# EAGLE schematic EpicWelcomeMusic (EAGLE 6.2)
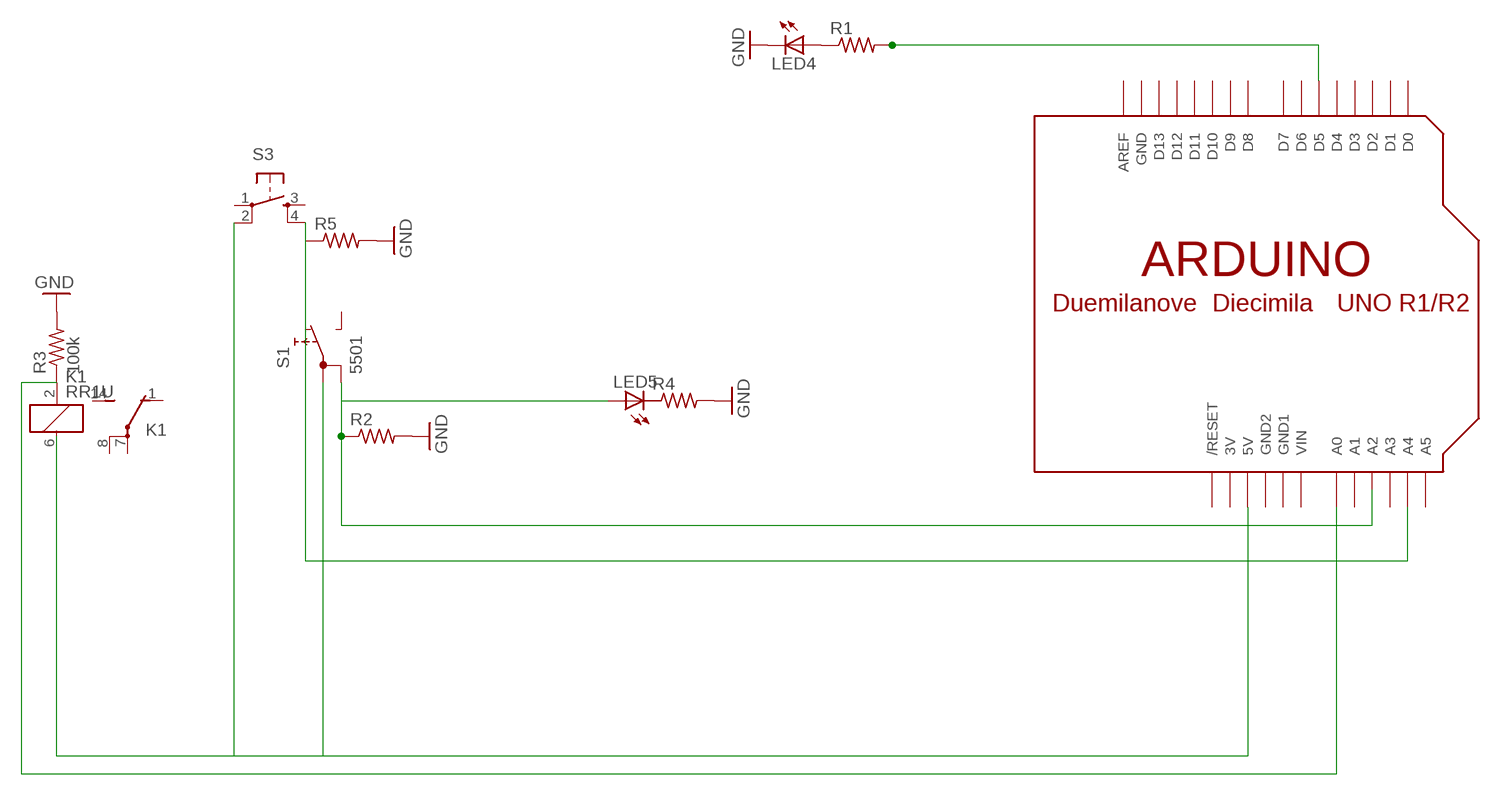
[diagram p0: schematic, sheet 1]

## Parts
K1  RR1U  [RR1U]
LED4  LED10MM  [LED10MM]
LED5  LED10MM  [LED10MM]
R1  R-US_0414/15  [0414/15]
R2  R-US_0414/15  [0414/15]
R3  100k  R-US_0414/15  [0414/15]
R4  R-US_0414/15  [0414/15]
R5  R-US_0414/15  [0414/15]
S1  5501  [5501]
S3  TAC_SWITCHPTH  [TACTILE-PTH]
U$1  ARDUINO-BPLACE  [ARDUINO-BPLACE]

## Nets
GND: LED4.C R2.2 R3.2 R4.2 R5.2
N$1: S1.1A S3.2 U$1.5V
N$2: K1.2 R3.1 U$1.A0
N$3: R1.2 U$1.D5
N$4: R5.1 S3.4 U$1.A4
N$5: LED4.A R1.1
N$6: LED5.A R2.1 S1.1B
Unconnected: K1.1(2:O) K1.6 K1.7(2:P) K1.8(2:P) K1.14(2:S) LED5.C R4.1 S1.NC S1.NO S3.1 S3.3 U$1.A1 U$1.A2 U$1.A3 U$1.A5 U$1.AREF U$1.D0 U$1.D1 U$1.D2 U$1.D3 U$1.D4 U$1.D6 U$1.D7 U$1.D8 U$1.D9 U$1.D10 U$1.D11 U$1.D12 U$1.D13 U$1.RESET(/RESET)

## Power pins joined to a net without a drawn wire
3V: U$1.3V
GND: U$1.GND
GND1: U$1.GND1
GND2: U$1.GND2
VIN: U$1.VIN

## Library data of the parts
K1 = relay:RR1U: RELAY reed, polarity, 1 x switch with shield; OC_FARNELL: unknown; OC_NEWARK: unknown
LED4 LED5 = SparkFun-LED:LED: LEDs Standard schematic elements and footprints for 5mm, 3mm, 1206, and 0603 sized LEDs. 5mm - Spark Fun Electronics SKU : COM-00529 (and others)
R1-R5 = adafruit:R-US_: RESISTOR, American symbol
S1 = switch:55?: PUSHBUTTON SERIES 5500 SWITCHES Source: www.e-switch.com .. 5500.pdf
S3 = SparkFun-Electromechanical:TAC_SWITCH: Momentary Switch Button commonly used for reset or general input. Spark Fun Electronics SKU : COM-00097
U$1 = adafruit:ARDUINO: Arduino Diecimila/Duemilanove Make a shield with ease, this package has all the named pins as well as the two mounting drill holes and an outline of the USB and DC power connector. The outline is on the DIMENSION layer, so if your board house uses it they will cut the outline to match. http://www.ladyada.net/library/pcb/eaglelibrary.html